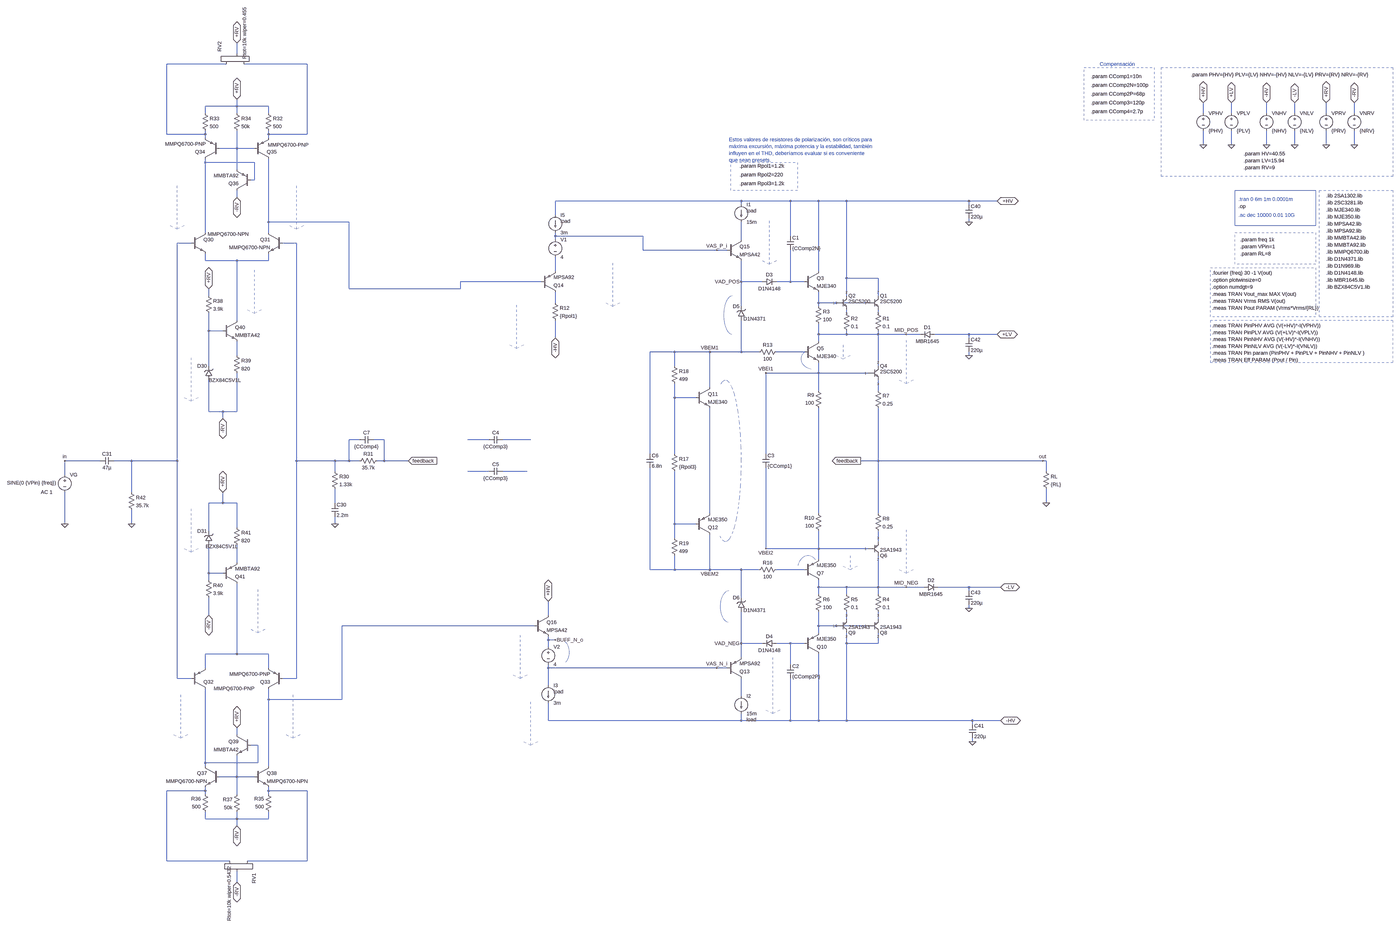
[diagram p0: schematic amplifier_V0.6_Test4.asc, whole sheet]
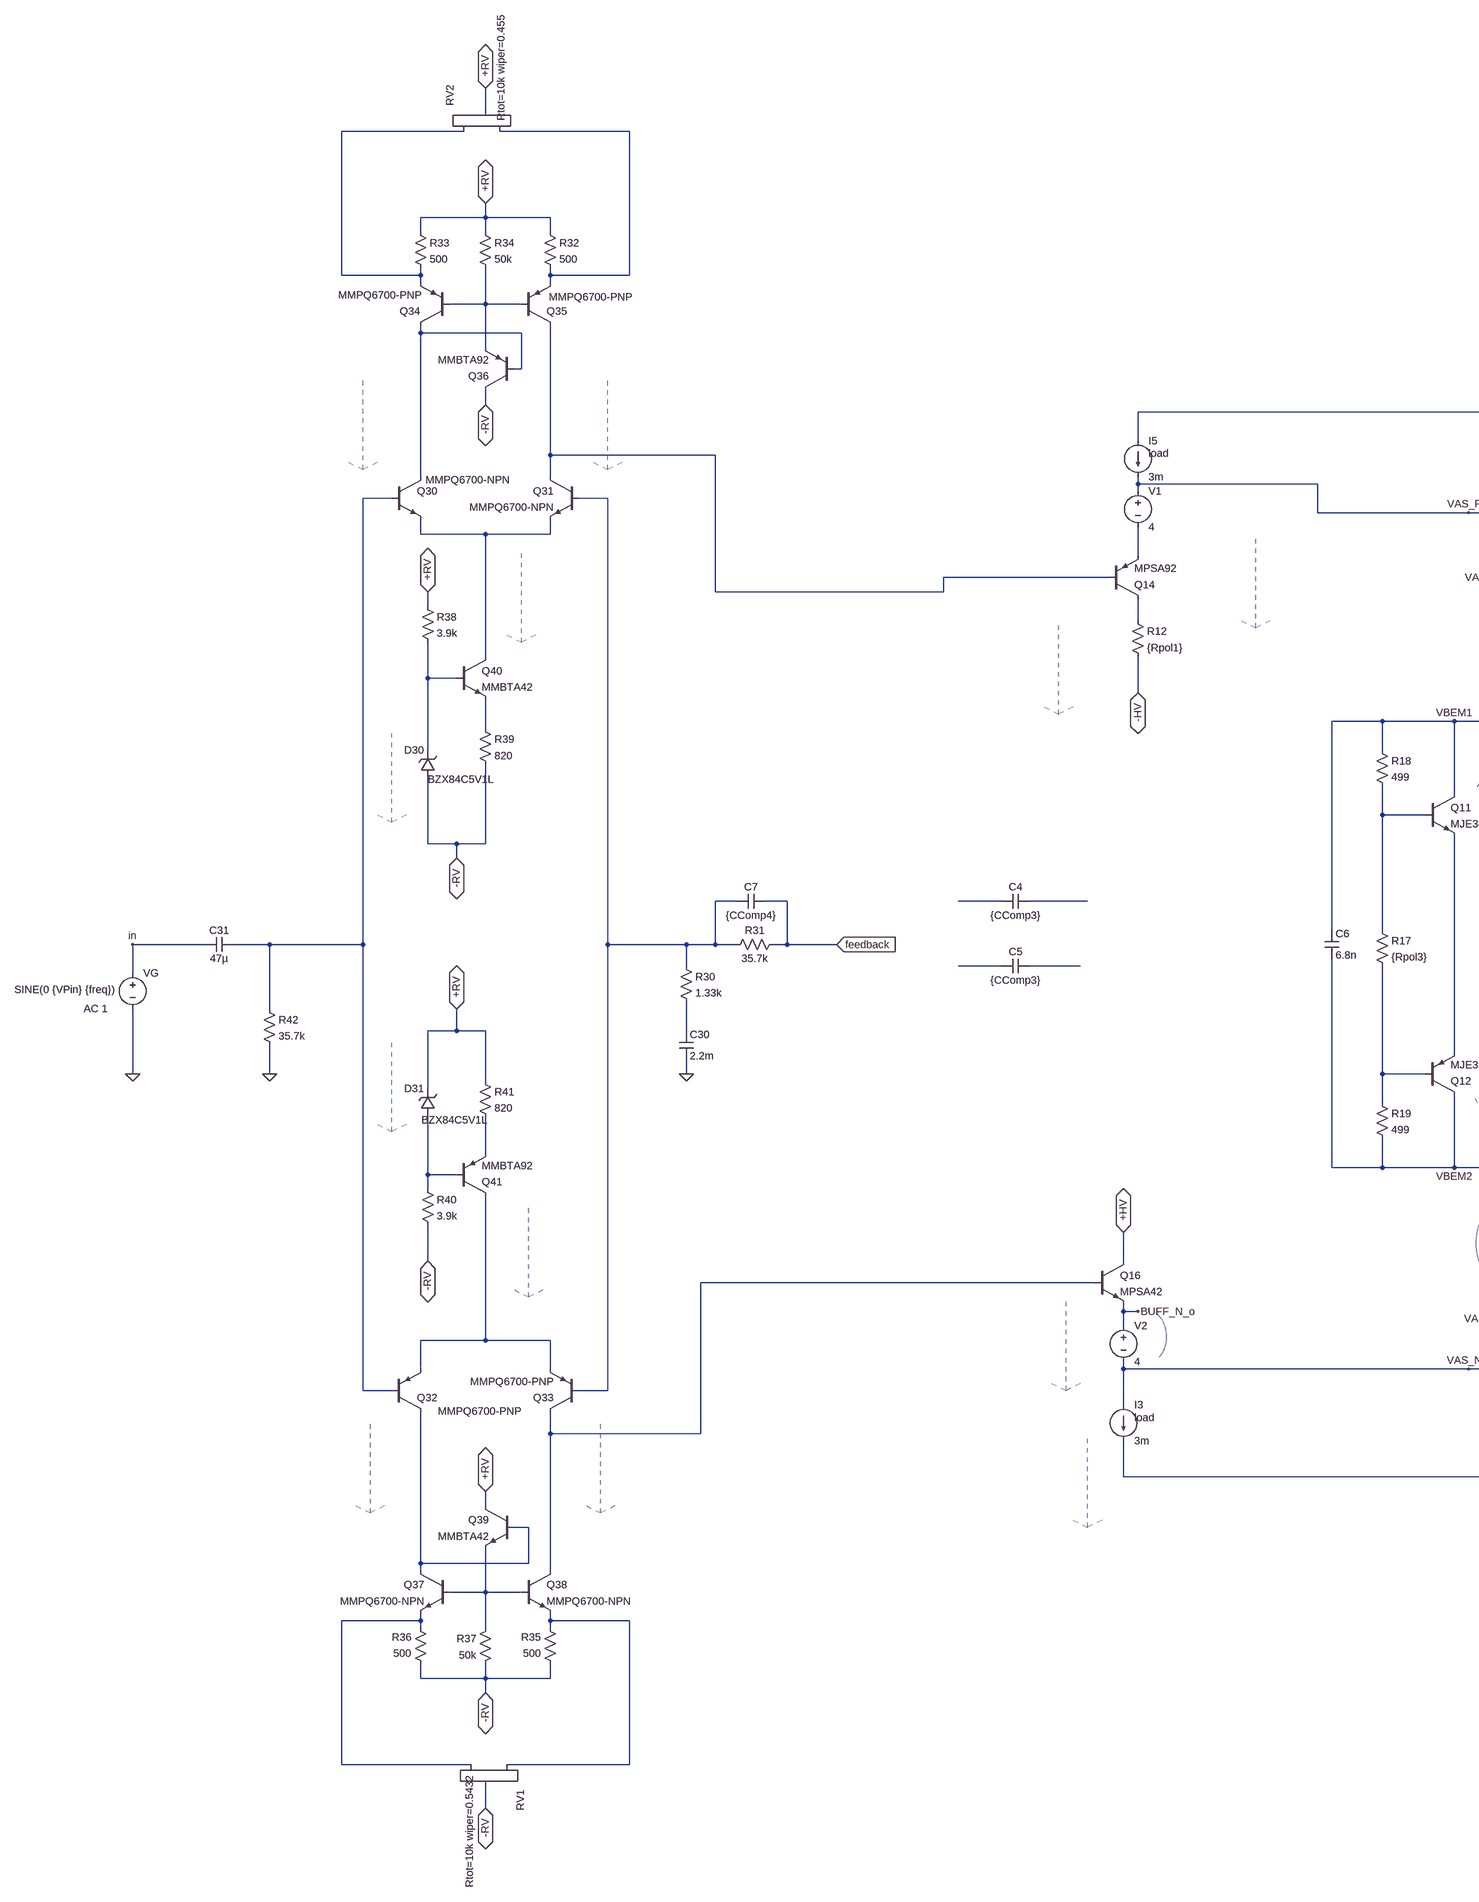
[diagram p1: schematic amplifier_V0.6_Test4.asc, part, row 1 of 1, column 1 of 2]
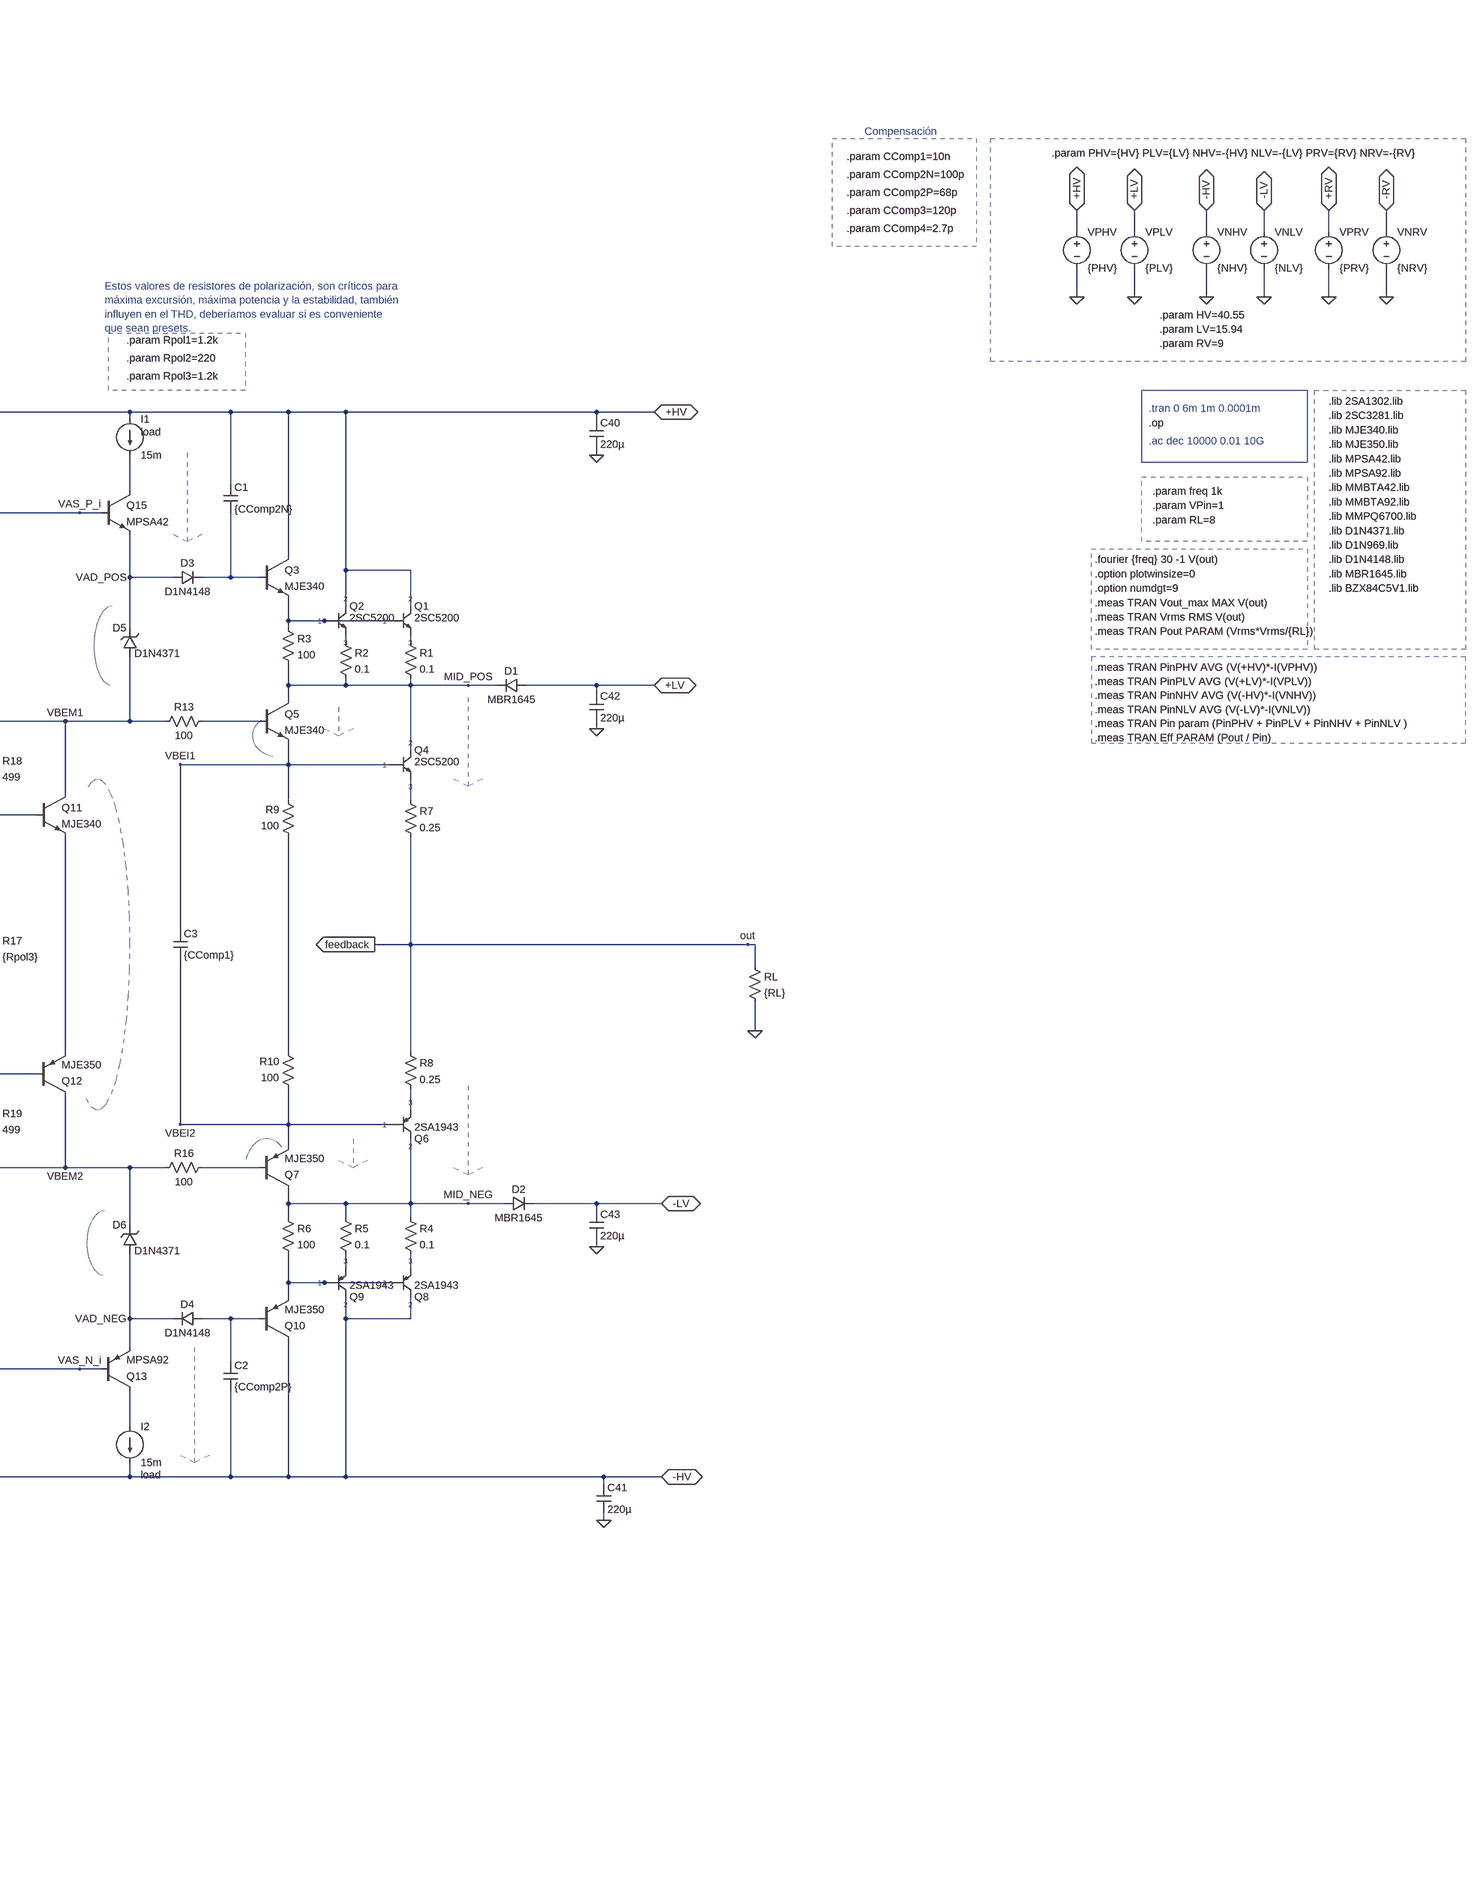
[diagram p2: schematic amplifier_V0.6_Test4.asc, part, row 1 of 1, column 2 of 2]
amplifier_V0.6_Test4.asc, the LTspice schematic file:
Version 4
SHEET 1 5164 2324
WIRE -2016 -1728 -2016 -1776
WIRE -2064 -1680 -2336 -1680
WIRE -1696 -1680 -1984 -1680
WIRE -2016 -1488 -2016 -1520
WIRE -2016 -1488 -2160 -1488
WIRE -1872 -1488 -2016 -1488
WIRE -2160 -1456 -2160 -1488
WIRE -2016 -1456 -2016 -1488
WIRE -1872 -1456 -1872 -1488
WIRE 4272 -1456 4272 -1504
WIRE 4400 -1456 4400 -1504
WIRE 4560 -1456 4560 -1504
WIRE 4688 -1456 4688 -1504
WIRE 4832 -1456 4832 -1504
WIRE 4960 -1456 4960 -1504
WIRE -2336 -1360 -2336 -1680
WIRE -2160 -1360 -2160 -1376
WIRE -2160 -1360 -2336 -1360
WIRE -1872 -1360 -1872 -1376
WIRE -1696 -1360 -1696 -1680
WIRE -1696 -1360 -1872 -1360
WIRE -2160 -1344 -2160 -1360
WIRE -1872 -1344 -1872 -1360
WIRE 4272 -1312 4272 -1376
WIRE 4400 -1312 4400 -1376
WIRE 4560 -1312 4560 -1376
WIRE 4688 -1312 4688 -1376
WIRE 4832 -1312 4832 -1376
WIRE 4960 -1312 4960 -1376
WIRE -2016 -1296 -2016 -1376
WIRE -2016 -1296 -2096 -1296
WIRE -1936 -1296 -2016 -1296
WIRE -2160 -1232 -2160 -1248
WIRE -1936 -1232 -2160 -1232
WIRE -2016 -1200 -2016 -1296
WIRE -1936 -1152 -1936 -1232
WIRE -1936 -1152 -1952 -1152
WIRE -2016 -1072 -2016 -1104
WIRE 992 -1056 -112 -1056
WIRE 1216 -1056 992 -1056
WIRE 1344 -1056 1216 -1056
WIRE 1472 -1056 1344 -1056
WIRE 2256 -1056 1472 -1056
WIRE 2384 -1056 2256 -1056
WIRE 992 -1040 992 -1056
WIRE 2256 -1040 2256 -1056
WIRE -112 -992 -112 -1056
WIRE -1872 -960 -1872 -1248
WIRE -1472 -960 -1872 -960
WIRE 2256 -960 2256 -976
WIRE -2160 -912 -2160 -1232
WIRE -1872 -912 -1872 -960
WIRE -112 -896 -112 -912
WIRE 544 -896 -112 -896
WIRE 1216 -896 1216 -1056
WIRE -112 -880 -112 -896
WIRE 992 -880 992 -960
WIRE -2224 -864 -2288 -864
WIRE -1744 -864 -1808 -864
WIRE 544 -832 544 -896
WIRE 880 -832 544 -832
WIRE 928 -832 880 -832
WIRE -2160 -784 -2160 -816
WIRE -2016 -784 -2160 -784
WIRE -1872 -784 -1872 -816
WIRE -1872 -784 -2016 -784
WIRE -112 -736 -112 -800
WIRE 1344 -736 1344 -1056
WIRE 1472 -704 1472 -1056
WIRE 1616 -704 1472 -704
WIRE -176 -688 -544 -688
WIRE 992 -688 992 -784
WIRE 1088 -688 992 -688
WIRE 1216 -688 1216 -832
WIRE 1216 -688 1152 -688
WIRE 1280 -688 1216 -688
WIRE -1472 -656 -1472 -960
WIRE -544 -656 -544 -688
WIRE -544 -656 -1472 -656
WIRE -2144 -624 -2144 -656
WIRE 1472 -624 1472 -704
WIRE 1616 -624 1616 -704
WIRE -112 -592 -112 -640
WIRE 1344 -592 1344 -640
WIRE 1424 -592 1344 -592
WIRE 1568 -592 1424 -592
WIRE 992 -576 992 -688
WIRE 1344 -576 1344 -592
WIRE 1472 -544 1472 -560
WIRE 1616 -544 1616 -560
WIRE -2016 -512 -2016 -784
WIRE -2144 -464 -2144 -544
WIRE -2080 -464 -2144 -464
WIRE 1344 -448 1344 -496
WIRE 1472 -448 1472 -464
WIRE 1472 -448 1344 -448
WIRE 1616 -448 1616 -464
WIRE 1616 -448 1472 -448
WIRE 1744 -448 1616 -448
WIRE 1808 -448 1744 -448
WIRE 2256 -448 1872 -448
WIRE 2384 -448 2256 -448
WIRE -112 -432 -112 -512
WIRE 2256 -432 2256 -448
WIRE 1344 -416 1344 -448
WIRE 688 -368 576 -368
WIRE 848 -368 688 -368
WIRE 992 -368 992 -512
WIRE 992 -368 848 -368
WIRE 1072 -368 992 -368
WIRE 1280 -368 1152 -368
WIRE -2016 -352 -2016 -416
WIRE 2256 -352 2256 -368
WIRE -2144 -304 -2144 -464
WIRE 688 -304 688 -368
WIRE 1616 -304 1616 -448
WIRE 1344 -272 1344 -320
WIRE 1344 -272 1104 -272
WIRE 1568 -272 1344 -272
WIRE 848 -208 848 -368
WIRE 1344 -192 1344 -272
WIRE 1616 -192 1616 -240
WIRE 688 -160 688 -224
WIRE 784 -160 688 -160
WIRE -2144 -96 -2144 -240
WIRE -2080 -96 -2144 -96
WIRE -2016 -96 -2016 -272
WIRE -2016 -96 -2080 -96
WIRE -2080 -64 -2080 -96
WIRE -1424 32 -1472 32
WIRE -1312 32 -1360 32
WIRE -416 32 -512 32
WIRE -224 32 -352 32
WIRE 576 96 576 -368
WIRE 688 96 688 -160
WIRE 1104 96 1104 -272
WIRE -2640 128 -2912 128
WIRE -2496 128 -2576 128
WIRE -2288 128 -2288 -864
WIRE -2288 128 -2496 128
WIRE -1744 128 -1744 -864
WIRE -1536 128 -1744 128
WIRE -1472 128 -1472 32
WIRE -1472 128 -1536 128
WIRE -1424 128 -1472 128
WIRE -1312 128 -1312 32
WIRE -1312 128 -1344 128
WIRE -1152 128 -1312 128
WIRE 1616 128 1616 -112
WIRE 1616 128 1536 128
WIRE 2592 128 1616 128
WIRE 2608 128 2592 128
WIRE -1536 176 -1536 128
WIRE -416 176 -512 176
WIRE -240 176 -352 176
WIRE 2608 176 2608 128
WIRE -2912 192 -2912 128
WIRE -2496 272 -2496 128
WIRE -2080 320 -2080 272
WIRE -2080 320 -2144 320
WIRE -2016 320 -2080 320
WIRE -1536 320 -1536 256
WIRE 2608 320 2608 256
WIRE 848 368 848 -112
WIRE 1344 368 1344 -112
WIRE 1616 368 1616 128
WIRE -2912 416 -2912 272
WIRE -2496 416 -2496 352
WIRE -1536 416 -1536 384
WIRE 688 416 688 176
WIRE 784 416 688 416
WIRE -2016 432 -2016 320
WIRE -2144 448 -2144 320
WIRE 688 480 688 416
WIRE 1616 496 1616 448
WIRE 1104 528 1104 160
WIRE 1344 528 1344 448
WIRE 1344 528 1104 528
WIRE 1568 528 1344 528
WIRE 1344 576 1344 528
WIRE -2016 592 -2016 512
WIRE 576 624 576 160
WIRE 688 624 688 560
WIRE 688 624 576 624
WIRE 848 624 848 464
WIRE 848 624 688 624
WIRE 992 624 848 624
WIRE 1072 624 992 624
WIRE 1280 624 1152 624
WIRE -2144 640 -2144 512
WIRE -2080 640 -2144 640
WIRE -2144 672 -2144 640
WIRE 1344 704 1344 672
WIRE 1472 704 1344 704
WIRE 1616 704 1616 560
WIRE 1616 704 1472 704
WIRE 1744 704 1616 704
WIRE 1824 704 1744 704
WIRE 2256 704 1888 704
WIRE 2400 704 2256 704
WIRE 2256 720 2256 704
WIRE 1344 736 1344 704
WIRE 1472 736 1472 704
WIRE 1616 736 1616 704
WIRE 992 752 992 624
WIRE 2256 800 2256 784
WIRE -2144 832 -2144 752
WIRE -144 832 -144 768
WIRE 1472 848 1472 816
WIRE 1616 848 1616 816
WIRE -208 880 -1504 880
WIRE 1344 880 1344 816
WIRE 1424 880 1344 880
WIRE 1568 880 1424 880
WIRE 1344 912 1344 880
WIRE -144 944 -144 928
WIRE -112 944 -144 944
WIRE 992 960 992 816
WIRE 1088 960 992 960
WIRE 1216 960 1152 960
WIRE 1280 960 1216 960
WIRE 1472 960 1472 912
WIRE 1616 960 1616 912
WIRE 1616 960 1472 960
WIRE -144 976 -144 944
WIRE -2016 1008 -2016 688
WIRE -2016 1008 -2160 1008
WIRE -1872 1008 -2016 1008
WIRE 992 1024 992 960
WIRE 1216 1056 1216 960
WIRE -2160 1072 -2160 1008
WIRE -1872 1072 -1872 1008
WIRE -144 1072 -144 1056
WIRE 880 1072 -144 1072
WIRE 928 1072 880 1072
WIRE -2288 1120 -2288 128
WIRE -2224 1120 -2288 1120
WIRE -1744 1120 -1744 128
WIRE -1744 1120 -1808 1120
WIRE -144 1152 -144 1072
WIRE 992 1200 992 1120
WIRE -1872 1216 -1872 1168
WIRE -1504 1216 -1504 880
WIRE -1504 1216 -1872 1216
WIRE -144 1312 -144 1232
WIRE 992 1312 992 1280
WIRE 992 1312 -144 1312
WIRE 1216 1312 1216 1120
WIRE 1216 1312 992 1312
WIRE 1344 1312 1344 1008
WIRE 1344 1312 1216 1312
WIRE 1472 1312 1472 960
WIRE 1472 1312 1344 1312
WIRE 2272 1312 1472 1312
WIRE 2400 1312 2272 1312
WIRE 2272 1328 2272 1312
WIRE -2016 1376 -2016 1344
WIRE 2272 1408 2272 1392
WIRE -1920 1424 -1952 1424
WIRE -2160 1504 -2160 1168
WIRE -1920 1504 -1920 1424
WIRE -1920 1504 -2160 1504
WIRE -2160 1520 -2160 1504
WIRE -1872 1520 -1872 1216
WIRE -2016 1568 -2016 1472
WIRE -2016 1568 -2096 1568
WIRE -1936 1568 -2016 1568
WIRE -2160 1632 -2160 1616
WIRE -2160 1632 -2336 1632
WIRE -1872 1632 -1872 1616
WIRE -1696 1632 -1872 1632
WIRE -2160 1648 -2160 1632
WIRE -2016 1648 -2016 1568
WIRE -1872 1648 -1872 1632
WIRE -2160 1760 -2160 1728
WIRE -2016 1760 -2016 1728
WIRE -2016 1760 -2160 1760
WIRE -1872 1760 -1872 1728
WIRE -1872 1760 -2016 1760
WIRE -2016 1792 -2016 1760
WIRE -2336 1952 -2336 1632
WIRE -2048 1952 -2336 1952
WIRE -1696 1952 -1696 1632
WIRE -1696 1952 -1968 1952
WIRE -2016 2048 -2016 2000
FLAG 848 -368 VBEM1
FLAG 848 624 VBEM2
FLAG 992 -688 VAD_POS
FLAG 992 960 VAD_NEG
FLAG 1744 704 MID_NEG
FLAG 1744 -448 MID_POS
FLAG 1104 -272 VBEI1
FLAG 1104 528 VBEI2
FLAG -2496 416 0
FLAG -1536 416 0
FLAG -2016 -1520 +RV
IOPIN -2016 -1520 BiDir
FLAG -2016 1792 -RV
IOPIN -2016 1792 BiDir
FLAG -2016 1344 +RV
IOPIN -2016 1344 BiDir
FLAG -2016 -1072 -RV
IOPIN -2016 -1072 BiDir
FLAG -2144 -656 +RV
IOPIN -2144 -656 BiDir
FLAG -2080 -64 -RV
IOPIN -2080 -64 BiDir
FLAG -2080 272 +RV
IOPIN -2080 272 BiDir
FLAG -2144 832 -RV
IOPIN -2144 832 BiDir
FLAG 2400 1312 -HV
IOPIN 2400 1312 BiDir
FLAG 2400 704 -LV
IOPIN 2400 704 BiDir
FLAG 2384 -1056 +HV
IOPIN 2384 -1056 BiDir
FLAG 2384 -448 +LV
IOPIN 2384 -448 BiDir
FLAG 2608 320 0
FLAG 2592 128 out
FLAG -1152 128 feedback
IOPIN -1152 128 In
FLAG 1536 128 feedback
IOPIN 1536 128 Out
FLAG -2912 416 0
FLAG -2912 128 in
FLAG 880 -832 VAS_P_i
FLAG 880 1072 VAS_N_i
FLAG -112 944 BUFF_N_o
FLAG 2256 -960 0
FLAG 2256 -352 0
FLAG 2256 800 0
FLAG 2272 1408 0
FLAG 4272 -1312 0
FLAG 4400 -1312 0
FLAG 4560 -1312 0
FLAG 4688 -1312 0
FLAG 4272 -1504 +HV
IOPIN 4272 -1504 BiDir
FLAG 4400 -1504 +LV
IOPIN 4400 -1504 BiDir
FLAG 4560 -1504 -HV
IOPIN 4560 -1504 BiDir
FLAG 4688 -1504 -LV
IOPIN 4688 -1504 BiDir
FLAG -2016 -1776 +RV
IOPIN -2016 -1776 BiDir
FLAG -2016 2048 -RV
IOPIN -2016 2048 BiDir
FLAG -112 -432 -HV
IOPIN -112 -432 BiDir
FLAG 4832 -1312 0
FLAG 4960 -1312 0
FLAG 4832 -1504 +RV
IOPIN 4832 -1504 BiDir
FLAG 4960 -1504 -RV
IOPIN 4960 -1504 BiDir
FLAG -144 768 +HV
IOPIN -144 768 BiDir
DATAFLAG 1392 704 "round($*100)/100"
DATAFLAG 1744 -304 "Ix(q4:2)"
DATAFLAG 1744 560 "-Ix(q6:2)"
DATAFLAG 992 128 "V(vbem1)-V(vbem2)"
DATAFLAG 1456 -368 "-Ie(Q5)"
DATAFLAG 1488 592 "Ie(Q7)"
DATAFLAG 848 -288 "Ic(Q11)"
DATAFLAG 848 544 "-Ic(Q12)"
DATAFLAG 912 -496 "V(vad_pos)-V(vbem1)"
DATAFLAG 896 784 "-(V(vad_neg)-V(vbem2))"
DATAFLAG 1280 -304 "V(vbem1)-V(vbei1)"
DATAFLAG 1264 576 "-(V(vbem2)-V(vbei2))"
DATAFLAG 992 624 ""
DATAFLAG 992 -368 ""
DATAFLAG 1120 -864 "Ic(Q15)"
DATAFLAG 1136 1136 "Ic(Q15)"
DATAFLAG 240 -672 "-Ic(Q17)"
DATAFLAG -16 1072 ""
DATAFLAG -944 -656 ""
DATAFLAG -1008 880 ""
DATAFLAG -1744 -1024 "Ic(Q31)"
DATAFLAG -2288 -1024 "Ic(Q30)"
DATAFLAG -2016 -784 ""
DATAFLAG -2272 1296 "-Ic(Q32)"
DATAFLAG -2016 1008 ""
DATAFLAG -2160 1328 ""
DATAFLAG -1760 1296 "-Ic(Q33)"
DATAFLAG -1872 1344 ""
DATAFLAG -2160 -1040 ""
DATAFLAG -1872 -1040 ""
DATAFLAG -2000 -1296 ""
DATAFLAG 2496 128 ""
DATAFLAG -2144 -480 ""
DATAFLAG -2016 -400 ""
DATAFLAG 1344 144 ""
DATAFLAG -1584 128 ""
DATAFLAG -48 1008 "V(VAS_P_i)-V(BUFF_P_o)"
DATAFLAG -1936 -640 "Ic(Q40)"
DATAFLAG -1920 816 "-Ic(Q41)"
DATAFLAG 1344 -592 ""
DATAFLAG 992 -928 ""
DATAFLAG 992 1168 ""
DATAFLAG 928 960 ""
DATAFLAG 1216 960 ""
DATAFLAG -272 1008 "-Ie(Q16)"
DATAFLAG 848 80 ""
DATAFLAG -2224 -240 "Ix(D30:-)"
DATAFLAG -2224 448 "Ix(D31:-)"
DATAFLAG -2128 640 ""
DATAFLAG -288 -480 "-Ic(Q14)"
DATAFLAG -224 1328 "I(R15)"
DATAFLAG -1248 128 ""
DATAFLAG 992 -720 ""
DATAFLAG 400 -1056 ""
DATAFLAG 176 -896 ""
DATAFLAG -112 -608 ""
DATAFLAG -112 -768 ""
SYMBOL npn 1280 -736 R0
SYMATTR InstName Q3
SYMATTR Value MJE340
SYMBOL res 1328 -592 R0
SYMATTR InstName R3
SYMATTR Value 100
SYMBOL diode 1088 -672 R270
WINDOW 0 32 32 VTop 2
WINDOW 3 0 32 VBottom 2
SYMATTR InstName D3
SYMATTR Value D1N4148
SYMBOL npn 1280 -416 R0
SYMATTR InstName Q5
SYMATTR Value MJE340
SYMBOL res 1600 -208 R0
SYMATTR InstName R7
SYMATTR Value 0.25
SYMBOL res 1360 -96 R180
WINDOW 0 36 76 Left 2
WINDOW 3 36 40 Left 2
SYMATTR InstName R9
SYMATTR Value 100
SYMBOL res 1600 352 R0
SYMATTR InstName R8
SYMATTR Value 0.25
SYMBOL pnp 1280 672 M180
SYMATTR InstName Q7
SYMATTR Value MJE350
SYMBOL pnp 1280 1008 M180
SYMATTR InstName Q10
SYMATTR Value MJE350
SYMBOL res 1328 720 R0
SYMATTR InstName R6
SYMATTR Value 100
SYMBOL diode 1152 944 R90
WINDOW 0 0 32 VBottom 2
WINDOW 3 32 32 VTop 2
SYMATTR InstName D4
SYMATTR Value D1N4148
SYMBOL diode 1824 720 R270
WINDOW 0 32 32 VTop 2
WINDOW 3 0 32 VBottom 2
SYMATTR InstName D2
SYMATTR Value MBR1645
SYMBOL res 1360 464 R180
WINDOW 0 36 76 Left 2
WINDOW 3 36 40 Left 2
SYMATTR InstName R10
SYMATTR Value 100
SYMBOL res 1600 720 R0
SYMATTR InstName R4
SYMATTR Value 0.1
SYMBOL res 1456 720 R0
SYMATTR InstName R5
SYMATTR Value 0.1
SYMBOL res 1456 -560 R0
SYMATTR InstName R2
SYMATTR Value 0.1
SYMBOL res 1600 -560 R0
SYMATTR InstName R1
SYMATTR Value 0.1
SYMBOL diode 1872 -432 M270
WINDOW 0 32 32 VTop 2
WINDOW 3 0 32 VBottom 2
SYMATTR InstName D1
SYMATTR Value MBR1645
SYMBOL pnp 784 464 M180
SYMATTR InstName Q12
SYMATTR Value MJE350
SYMBOL npn 784 -208 R0
SYMATTR InstName Q11
SYMATTR Value MJE340
SYMBOL res 672 80 R0
SYMATTR InstName R17
SYMATTR Value {Rpol3}
SYMBOL res 672 -320 R0
SYMATTR InstName R18
SYMATTR Value 499
SYMBOL res 672 464 R0
SYMATTR InstName R19
SYMATTR Value 499
SYMBOL cap 1088 96 R0
SYMATTR InstName C3
SYMATTR Value {CComp1}
SYMBOL res 1168 -384 R90
WINDOW 0 0 56 VBottom 2
WINDOW 3 32 56 VTop 2
SYMATTR InstName R13
SYMATTR Value 100
SYMBOL res 1168 608 R90
WINDOW 0 0 56 VBottom 2
WINDOW 3 32 56 VTop 2
SYMATTR InstName R16
SYMATTR Value 100
SYMBOL pnp 928 1120 M180
SYMATTR InstName Q13
SYMATTR Value MPSA92
SYMBOL npn 928 -880 R0
SYMATTR InstName Q15
SYMATTR Value MPSA42
SYMBOL cap 560 96 R0
SYMATTR InstName C6
SYMATTR Value 6.8n
SYMBOL npn -208 832 R0
SYMATTR InstName Q16
SYMATTR Value MPSA42
SYMBOL res -1552 160 R0
SYMATTR InstName R30
SYMATTR Value 1.33k
SYMBOL res -1328 112 R90
WINDOW 0 0 56 VBottom 2
WINDOW 3 32 56 VTop 2
SYMATTR InstName R31
SYMATTR Value 35.7k
SYMBOL res -2512 256 R0
SYMATTR InstName R42
SYMATTR Value 35.7k
SYMBOL cap -1552 320 R0
SYMATTR InstName C30
SYMATTR Value 2.2m
SYMBOL cap -2576 112 R90
WINDOW 0 0 32 VBottom 2
WINDOW 3 32 32 VTop 2
SYMATTR InstName C31
SYMATTR Value 47µ
SYMBOL npn -2224 -912 R0
WINDOW 3 75 7 Left 2
SYMATTR Value MMPQ6700-NPN
SYMATTR InstName Q30
SYMBOL npn -1808 -912 M0
SYMATTR InstName Q31
SYMATTR Value MMPQ6700-NPN
SYMBOL pnp -2224 1168 M180
WINDOW 3 102 2 Left 2
SYMATTR Value MMPQ6700-PNP
SYMATTR InstName Q32
SYMBOL pnp -1808 1168 R180
SYMATTR InstName Q33
SYMATTR Value MMPQ6700-PNP
SYMBOL cap -352 16 R90
WINDOW 0 0 32 VBottom 2
WINDOW 3 32 32 VTop 2
SYMATTR InstName C4
SYMATTR Value {CComp3}
SYMBOL cap -352 160 R90
WINDOW 0 0 32 VBottom 2
WINDOW 3 32 32 VTop 2
SYMATTR InstName C5
SYMATTR Value {CComp3}
SYMBOL pnp -1936 -1248 M180
WINDOW 3 61 64 Left 2
SYMATTR Value MMPQ6700-PNP
SYMATTR InstName Q35
SYMBOL pnp -2096 -1248 R180
WINDOW 0 65 32 Left 2
WINDOW 3 61 68 Left 2
SYMATTR InstName Q34
SYMATTR Value MMPQ6700-PNP
SYMBOL npn -2096 1520 M0
SYMATTR InstName Q37
SYMATTR Value MMPQ6700-NPN
SYMBOL npn -1936 1520 R0
SYMATTR InstName Q38
SYMATTR Value MMPQ6700-NPN
SYMBOL res -2176 -1472 R0
SYMATTR InstName R33
SYMATTR Value 500
SYMBOL res -1888 -1472 R0
SYMATTR InstName R32
SYMATTR Value 500
SYMBOL res -1856 1744 R180
WINDOW 0 36 76 Left 2
WINDOW 3 36 40 Left 2
SYMATTR InstName R35
SYMATTR Value 500
SYMBOL res -2144 1744 R180
WINDOW 0 36 76 Left 2
WINDOW 3 36 40 Left 2
SYMATTR InstName R36
SYMATTR Value 500
SYMBOL npn -1952 1376 M0
SYMATTR InstName Q39
SYMATTR Value MMBTA42
SYMBOL pnp -1952 -1104 R180
SYMATTR InstName Q36
SYMATTR Value MMBTA92
SYMBOL res -2000 1632 M0
SYMATTR InstName R37
SYMATTR Value 50k
SYMBOL res -2032 -1472 R0
SYMATTR InstName R34
SYMATTR Value 50k
SYMBOL 2SC5200 1440 -608 R0
SYMATTR InstName Q2
SYMBOL 2SC5200 1584 -608 R0
SYMATTR InstName Q1
SYMBOL 2SC5200 1584 -288 R0
SYMATTR InstName Q4
SYMBOL 2SA1943 1584 544 M180
SYMATTR InstName Q6
SYMBOL 2SA1943 1440 896 M180
SYMATTR InstName Q9
SYMBOL 2SA1943 1584 896 M180
SYMATTR InstName Q8
SYMBOL res -2160 -640 R0
SYMATTR InstName R38
SYMATTR Value 3.9k
SYMBOL npn -2080 -512 R0
SYMATTR InstName Q40
SYMATTR Value MMBTA42
SYMBOL res -2032 -368 R0
SYMATTR InstName R39
SYMATTR Value 820
SYMBOL pnp -2080 688 M180
SYMATTR InstName Q41
SYMATTR Value MMBTA92
SYMBOL res -2032 416 R0
SYMATTR InstName R41
SYMATTR Value 820
SYMBOL res -2160 656 R0
SYMATTR InstName R40
SYMATTR Value 3.9k
SYMBOL res 2592 160 R0
SYMATTR InstName RL
SYMATTR Value {RL}
SYMBOL cap 1200 1056 R0
SYMATTR InstName C2
SYMATTR Value {CComp2P}
SYMBOL cap 1200 -896 R0
SYMATTR InstName C1
SYMATTR Value {CComp2N}
SYMBOL voltage -2912 176 R0
WINDOW 3 -263 52 Left 2
WINDOW 123 -109 95 Left 2
WINDOW 39 0 0 Left 2
SYMATTR Value SINE(0 {VPin} {freq})
SYMATTR Value2 AC 1
SYMATTR InstName VG
SYMBOL zener 1008 -512 R180
WINDOW 0 24 64 Left 2
WINDOW 3 -96 7 Left 2
SYMATTR InstName D5
SYMATTR Value D1N4371
SYMBOL zener 1008 816 R180
WINDOW 0 24 64 Left 2
WINDOW 3 -96 7 Left 2
SYMATTR InstName D6
SYMATTR Value D1N4371
SYMBOL cap 2240 -1040 R0
SYMATTR InstName C40
SYMATTR Value 220µ
SYMBOL cap 2240 -432 R0
SYMATTR InstName C42
SYMATTR Value 220µ
SYMBOL cap 2240 720 R0
SYMATTR InstName C43
SYMATTR Value 220µ
SYMBOL cap 2256 1328 R0
SYMATTR InstName C41
SYMATTR Value 220µ
SYMBOL zener -2128 -240 R180
WINDOW 0 24 64 Left 2
WINDOW 3 -131 -1 Left 2
SYMATTR InstName D30
SYMATTR Value BZX84C5V1L
SYMATTR Prefix X
SYMBOL zener -2128 512 R180
WINDOW 0 24 64 Left 2
WINDOW 3 -117 -6 Left 2
SYMATTR InstName D31
SYMATTR Value BZX84C5V1L
SYMATTR Prefix X
SYMBOL voltage 4272 -1472 R0
SYMATTR InstName VPHV
SYMATTR Value {PHV}
SYMBOL voltage 4400 -1472 R0
SYMATTR InstName VPLV
SYMATTR Value {PLV}
SYMBOL voltage 4560 -1472 R0
SYMATTR InstName VNHV
SYMATTR Value {NHV}
SYMBOL voltage 4688 -1472 R0
SYMATTR InstName VNLV
SYMATTR Value {NLV}
SYMBOL potentiometer_standard -1952 1936 R90
WINDOW 3 39 99 Left 2
SYMATTR Value Rtot=10k wiper=0.5432
SYMATTR InstName RV1
SYMATTR SpiceLine ""
SYMBOL potentiometer_standard -2080 -1664 R270
WINDOW 3 39 99 Left 2
SYMATTR Value Rtot=10k wiper=0.455
SYMATTR InstName RV2
SYMATTR SpiceLine ""
SYMBOL cap -1360 16 R90
WINDOW 0 0 32 VBottom 2
WINDOW 3 32 32 VTop 2
SYMATTR InstName C7
SYMATTR Value {CComp4}
SYMBOL current 992 -1040 R0
WINDOW 123 0 0 Left 0
WINDOW 39 24 28 Left 2
SYMATTR InstName I1
SYMATTR Value 15m
SYMATTR SpiceLine load
SYMBOL current 992 1200 R0
WINDOW 123 0 0 Left 0
WINDOW 39 24 108 Left 2
SYMATTR InstName I2
SYMATTR Value 15m
SYMATTR SpiceLine load
SYMBOL res -128 -608 R0
SYMATTR InstName R12
SYMATTR Value {Rpol1}
SYMBOL pnp -176 -640 M180
SYMATTR InstName Q14
SYMATTR Value MPSA92
SYMBOL voltage -112 -896 R0
SYMATTR InstName V1
SYMATTR Value 4
SYMBOL current -112 -992 R0
WINDOW 123 0 0 Left 0
WINDOW 39 24 28 Left 2
SYMATTR InstName I5
SYMATTR Value 3m
SYMATTR SpiceLine load
SYMBOL voltage 4832 -1472 R0
SYMATTR InstName VPRV
SYMATTR Value {PRV}
SYMBOL voltage 4960 -1472 R0
SYMATTR InstName VNRV
SYMATTR Value {NRV}
SYMBOL current -144 1152 R0
WINDOW 123 0 0 Left 0
WINDOW 39 24 28 Left 2
SYMATTR InstName I3
SYMATTR Value 3m
SYMATTR SpiceLine load
SYMBOL voltage -144 960 R0
SYMATTR InstName V2
SYMATTR Value 4
TEXT 4432 -1064 Left 2 ;.tran 0 6m 1m 0.0001m
TEXT 4440 -880 Left 2 !.param freq 1k
TEXT 4432 -1032 Left 2 !.op
TEXT 4312 -728 Left 2 !.fourier {freq} 30 -1 V(out)
TEXT 4832 -1080 Left 2 !.lib 2SA1302.lib
TEXT 4832 -1048 Left 2 !.lib 2SC3281.lib
TEXT 4832 -792 Left 2 !.lib D1N4371.lib
TEXT 4832 -696 Left 2 !.lib MBR1645.lib
TEXT 4832 -1016 Left 2 !.lib MJE340.lib
TEXT 4832 -984 Left 2 !.lib MJE350.lib
TEXT 4832 -728 Left 2 !.lib D1N4148.lib
TEXT 4832 -952 Left 2 !.lib MPSA42.lib
TEXT 4832 -920 Left 2 !.lib MPSA92.lib
TEXT 4832 -760 Left 2 !.lib D1N969.lib
TEXT 4432 -992 Left 2 ;.ac dec 10000 0.01 10G
TEXT 4440 -848 Left 2 !.param VPin=1
TEXT 4832 -664 Left 2 !.lib BZX84C5V1.lib
TEXT 4832 -888 Left 2 !.lib MMBTA42.lib
TEXT 4832 -856 Left 2 !.lib MMBTA92.lib
TEXT 4832 -824 Left 2 !.lib MMPQ6700.lib
TEXT 4312 -696 Left 2 !.option plotwinsize=0
TEXT 4312 -600 Left 2 !.meas TRAN Vrms RMS V(out)
TEXT 4312 -568 Left 2 !.meas TRAN Pout PARAM (Vrms*Vrms/{RL})
TEXT 4312 -664 Left 2 !.option numdgt=9
TEXT 4312 -632 Left 2 !.meas TRAN Vout_max MAX V(out)
TEXT 4440 -816 Left 2 !.param RL=8
TEXT 4312 -488 Left 2 !.meas TRAN PinPHV AVG (V(+HV)*-I(VPHV))\n.meas TRAN PinPLV AVG (V(+LV)*-I(VPLV))\n.meas TRAN PinNHV AVG (V(-HV)*-I(VNHV))\n.meas TRAN PinNLV AVG (V(-LV)*-I(VNLV))\n.meas TRAN Pin param (PinPHV + PinPLV + PinNHV + PinNLV )\n.meas TRAN Eff PARAM (Pout / Pin)
TEXT 4216 -1632 Left 2 !.param PHV={HV} PLV={LV} NHV=-{HV} NLV=-{LV} PRV={RV} NRV=-{RV}
TEXT 4456 -1272 Left 2 !.param HV=40.55
TEXT 4456 -1240 Left 2 !.param LV=15.94
TEXT 984 -1216 Left 2 !.param Rpol1=1.2k
TEXT 984 -1176 Left 2 !.param Rpol2=220
TEXT 984 -1136 Left 2 !.param Rpol3=1.2k
TEXT 936 -1336 Left 2 ;Estos valores de resistores de polarización, son críticos para\nmáxima excursión, máxima potencia y la estabilidad, también\ninfluyen en el THD, deberíamos evaluar si es conveniente\nque sean presets.
TEXT 3760 -1624 Left 2 !.param CComp1=10n
TEXT 3760 -1584 Left 2 !.param CComp2N=100p
TEXT 3760 -1504 Left 2 !.param CComp3=120p
TEXT 3800 -1680 Left 2 ;Compensación
TEXT 3760 -1544 Left 2 !.param CComp2P=68p
TEXT 3760 -1464 Left 2 !.param CComp4=2.7p
TEXT 4456 -1208 Left 2 !.param RV=9
LINE Normal 240 -576 240 -784 2
LINE Normal 1744 -224 1744 -432 2
LINE Normal 1776 -240 1744 -224 2
LINE Normal 1712 -240 1744 -224 2
LINE Normal 1744 640 1744 432 2
LINE Normal 1776 624 1744 640 2
LINE Normal 1712 624 1744 640 2
LINE Normal 1152 -784 1120 -768 2
LINE Normal 1088 -784 1120 -768 2
LINE Normal 1136 1280 1136 1024 2
LINE Normal 1488 -352 1456 -336 2
LINE Normal 1424 -352 1456 -336 2
LINE Normal 1456 -400 1456 -336 2
LINE Normal 1520 608 1488 624 2
LINE Normal 1456 608 1488 624 2
LINE Normal 1488 560 1488 624 2
LINE Normal -1744 -928 -1744 -1136 2
LINE Normal -1712 -944 -1744 -928 2
LINE Normal -1776 -944 -1744 -928 2
LINE Normal -2288 -928 -2288 -1136 2
LINE Normal -2256 -944 -2288 -928 2
LINE Normal -2320 -944 -2288 -928 2
LINE Normal -2272 1392 -2272 1184 2
LINE Normal -2240 1376 -2272 1392 2
LINE Normal -2304 1376 -2272 1392 2
LINE Normal -1760 1392 -1760 1184 2
LINE Normal -1728 1376 -1760 1392 2
LINE Normal -1792 1376 -1760 1392 2
LINE Normal 208 -592 240 -576 2
LINE Normal 272 -592 240 -576 2
LINE Normal -1936 -544 -1936 -752 2
LINE Normal -1968 -560 -1936 -544 2
LINE Normal -1904 -560 -1936 -544 2
LINE Normal -1920 912 -1920 704 2
LINE Normal -1952 896 -1920 912 2
LINE Normal -1888 896 -1920 912 2
LINE Normal 1120 -768 1120 -976 2
LINE Normal 1168 1264 1136 1280 2
LINE Normal 1104 1264 1136 1280 2
LINE Normal -272 1120 -272 912 2
LINE Normal -240 1104 -272 1120 2
LINE Normal -304 1104 -272 1120 2
LINE Normal -2224 -144 -2224 -352 2
LINE Normal -2256 -160 -2224 -144 2
LINE Normal -2192 -160 -2224 -144 2
LINE Normal -2224 544 -2224 336 2
LINE Normal -2256 528 -2224 544 2
LINE Normal -2192 528 -2224 544 2
LINE Normal -288 -384 -288 -592 2
LINE Normal -320 -400 -288 -384 2
LINE Normal -256 -400 -288 -384 2
LINE Normal -224 1424 -224 1216 2
LINE Normal -256 1408 -224 1424 2
LINE Normal -192 1408 -224 1424 2
RECTANGLE Normal 4784 -944 4416 -1104
RECTANGLE Normal 4784 -768 4416 -912 3
RECTANGLE Normal 5136 -528 4800 -1104 2
RECTANGLE Normal 4784 -528 4304 -752 3
RECTANGLE Normal 4304 -320 5136 -512 3
RECTANGLE Normal 5136 -1168 4080 -1664 4
RECTANGLE Normal 1248 -1104 944 -1232 2
RECTANGLE Normal 4048 -1424 3728 -1664 1
ARC Normal 1264 -384 1392 -288 1267 -382 1296 -253 3
ARC Normal 1344 560 1248 688 1342 563 1213 592 3
ARC Normal 848 -240 992 496 893 485 891 -235 2
ARC Normal 976 720 896 864 936 712 932 870 2
ARC Normal 992 -624 912 -448 952 -632 948 -442 2
ARC Normal -48 1056 -128 944 -48 1075 -70 944 2

The netlist it stands for:
* amplifier_V0.6_Test4.asc
Q3 +HV N011 N013 0 MJE340
R3 N013 MID_POS 100
D3 VAD_POS N011 D1N4148
Q5 MID_POS N017 VBEI1 0 MJE340
R7 N019 feedback 0.25
R9 N027 VBEI1 100
R8 feedback N029 0.25
Q7 MID_NEG N031 VBEI2 0 MJE350
Q10 -HV N037 N036 0 MJE350
R6 MID_NEG N036 100
D4 N037 VAD_NEG D1N4148
D2 MID_NEG -LV MBR1645
R10 VBEI2 N027 100
R4 MID_NEG N034 0.1
R5 MID_NEG N033 0.1
R2 N014 MID_POS 0.1
R1 N015 MID_POS 0.1
D1 +LV MID_POS MBR1645
Q12 VBEM2 N028 N026 0 MJE350
Q11 VBEM1 N020 N026 0 MJE340
R17 N020 N028 {Rpol3}
R18 VBEM1 N020 499
R19 N028 VBEM2 499
C3 VBEI1 VBEI2 {CComp1}
R13 N017 VBEM1 100
R16 N031 VBEM2 100
Q13 N039 VAS_N_i VAD_NEG 0 MPSA92
Q15 N006 VAS_P_i VAD_POS 0 MPSA42
C6 VBEM1 VBEM2 6.8n
Q16 +HV N035 BUFF_N_o 0 MPSA42
R30 N008 N025 1.33k
R31 feedback N008 35.7k
R42 N007 0 35.7k
C30 N025 0 2.2m
C31 N007 in 47µ
Q30 N004 N007 N009 0 MMPQ6700-NPN
Q31 N005 N008 N009 0 MMPQ6700-NPN
Q32 N040 N007 N038 0 MMPQ6700-PNP
Q33 N035 N008 N038 0 MMPQ6700-PNP
C4 N022 N021 {CComp3}
C5 N024 N023 {CComp3}
Q35 N005 N003 N002 0 MMPQ6700-PNP
Q34 N004 N003 N001 0 MMPQ6700-PNP
Q37 N040 N041 N042 0 MMPQ6700-NPN
Q38 N035 N041 N043 0 MMPQ6700-NPN
R33 +RV N001 500
R32 +RV N002 500
R35 -RV N043 500
R36 -RV N042 500
Q39 +RV N040 N041 0 MMBTA42
Q36 -RV N004 N003 0 MMBTA92
R37 N041 -RV 50k
R34 +RV N003 50k
XQ2 +HV N013 N014 2SC5200  ; pins 2 1 3
XQ1 +HV N013 N015 2SC5200  ; pins 2 1 3
XQ4 MID_POS VBEI1 N019 2SC5200  ; pins 2 1 3
XQ6 MID_NEG VBEI2 N029 2SA1943  ; pins 2 1 3
XQ9 -HV N036 N033 2SA1943  ; pins 2 1 3
XQ8 -HV N036 N034 2SA1943  ; pins 2 1 3
R38 +RV N016 3.9k
Q40 N009 N016 N018 0 MMBTA42
R39 N018 -RV 820
Q41 N038 N032 N030 0 MMBTA92
R41 +RV N030 820
R40 N032 -RV 3.9k
RL feedback 0 {RL}
C2 N037 -HV {CComp2P}
C1 +HV N011 {CComp2N}
VG in 0 SINE(0 {VPin} {freq}) AC 1
D5 VBEM1 VAD_POS D1N4371
D6 VAD_NEG VBEM2 D1N4371
C40 +HV 0 220µ
C42 +LV 0 220µ
C43 -LV 0 220µ
C41 -HV 0 220µ
XD30 -RV N016 BZX84C5V1L  ; pins + -
XD31 N032 +RV BZX84C5V1L  ; pins + -
VPHV +HV 0 {PHV}
VPLV +LV 0 {PLV}
VNHV -HV 0 {NHV}
VNLV -LV 0 {NLV}
XRV1 N043 N042 -RV Rtot=10k wiper=0.5432
XRV2 N001 N002 +RV Rtot=10k wiper=0.455
C7 feedback N008 {CComp4}
I1 +HV N006 15m load
I2 N039 -HV 15m load
R12 N012 -HV {Rpol1}
Q14 N012 N005 N010 0 MPSA92
V1 VAS_P_i N010 4
I5 +HV VAS_P_i 3m load
VPRV +RV 0 {PRV}
VNRV -RV 0 {NRV}
I3 VAS_N_i -HV 3m load
V2 BUFF_N_o VAS_N_i 4
.model D D
.lib standard.dio
.model NPN NPN
.model PNP PNP
.lib standard.bjt
* .tran 0 6m 1m 0.0001m
.param freq 1k
.op
.fourier {freq} 30 -1 V(out)
.lib 2SA1302.lib
.lib 2SC3281.lib
.lib D1N4371.lib
.lib MBR1645.lib
.lib MJE340.lib
.lib MJE350.lib
.lib D1N4148.lib
.lib MPSA42.lib
.lib MPSA92.lib
.lib D1N969.lib
* .ac dec 10000 0.01 10G
.param VPin=1
.lib BZX84C5V1.lib
.lib MMBTA42.lib
.lib MMBTA92.lib
.lib MMPQ6700.lib
.option plotwinsize=0
.meas TRAN Vrms RMS V(out)
.meas TRAN Pout PARAM (Vrms*Vrms/{RL})
.option numdgt=9
.meas TRAN Vout_max MAX V(out)
.param RL=8
.meas TRAN PinPHV AVG (V(+HV)*-I(VPHV))
.meas TRAN PinPLV AVG (V(+LV)*-I(VPLV))
.meas TRAN PinNHV AVG (V(-HV)*-I(VNHV))
.meas TRAN PinNLV AVG (V(-LV)*-I(VNLV))
.meas TRAN Pin param (PinPHV + PinPLV + PinNHV + PinNLV )
.meas TRAN Eff PARAM (Pout / Pin)
.param PHV={HV} PLV={LV} NHV=-{HV} NLV=-{LV} PRV={RV} NRV=-{RV}
.param HV=40.55
.param LV=15.94
.param Rpol1=1.2k
.param Rpol2=220
.param Rpol3=1.2k
* Estos valores de resistores de polarización, son críticos para
* máxima excursión, máxima potencia y la estabilidad, también
* influyen en el THD, deberíamos evaluar si es conveniente
* que sean presets.
.param CComp1=10n
.param CComp2N=100p
.param CComp3=120p
* Compensación
.param CComp2P=68p
.param CComp4=2.7p
.param RV=9
.lib 2SC5200.mod
.lib 2SA1943.mod
.backanno
.end